# EAGLE design CP2102 USB to Serial Breakout v12 (EAGLE 6.5.0)
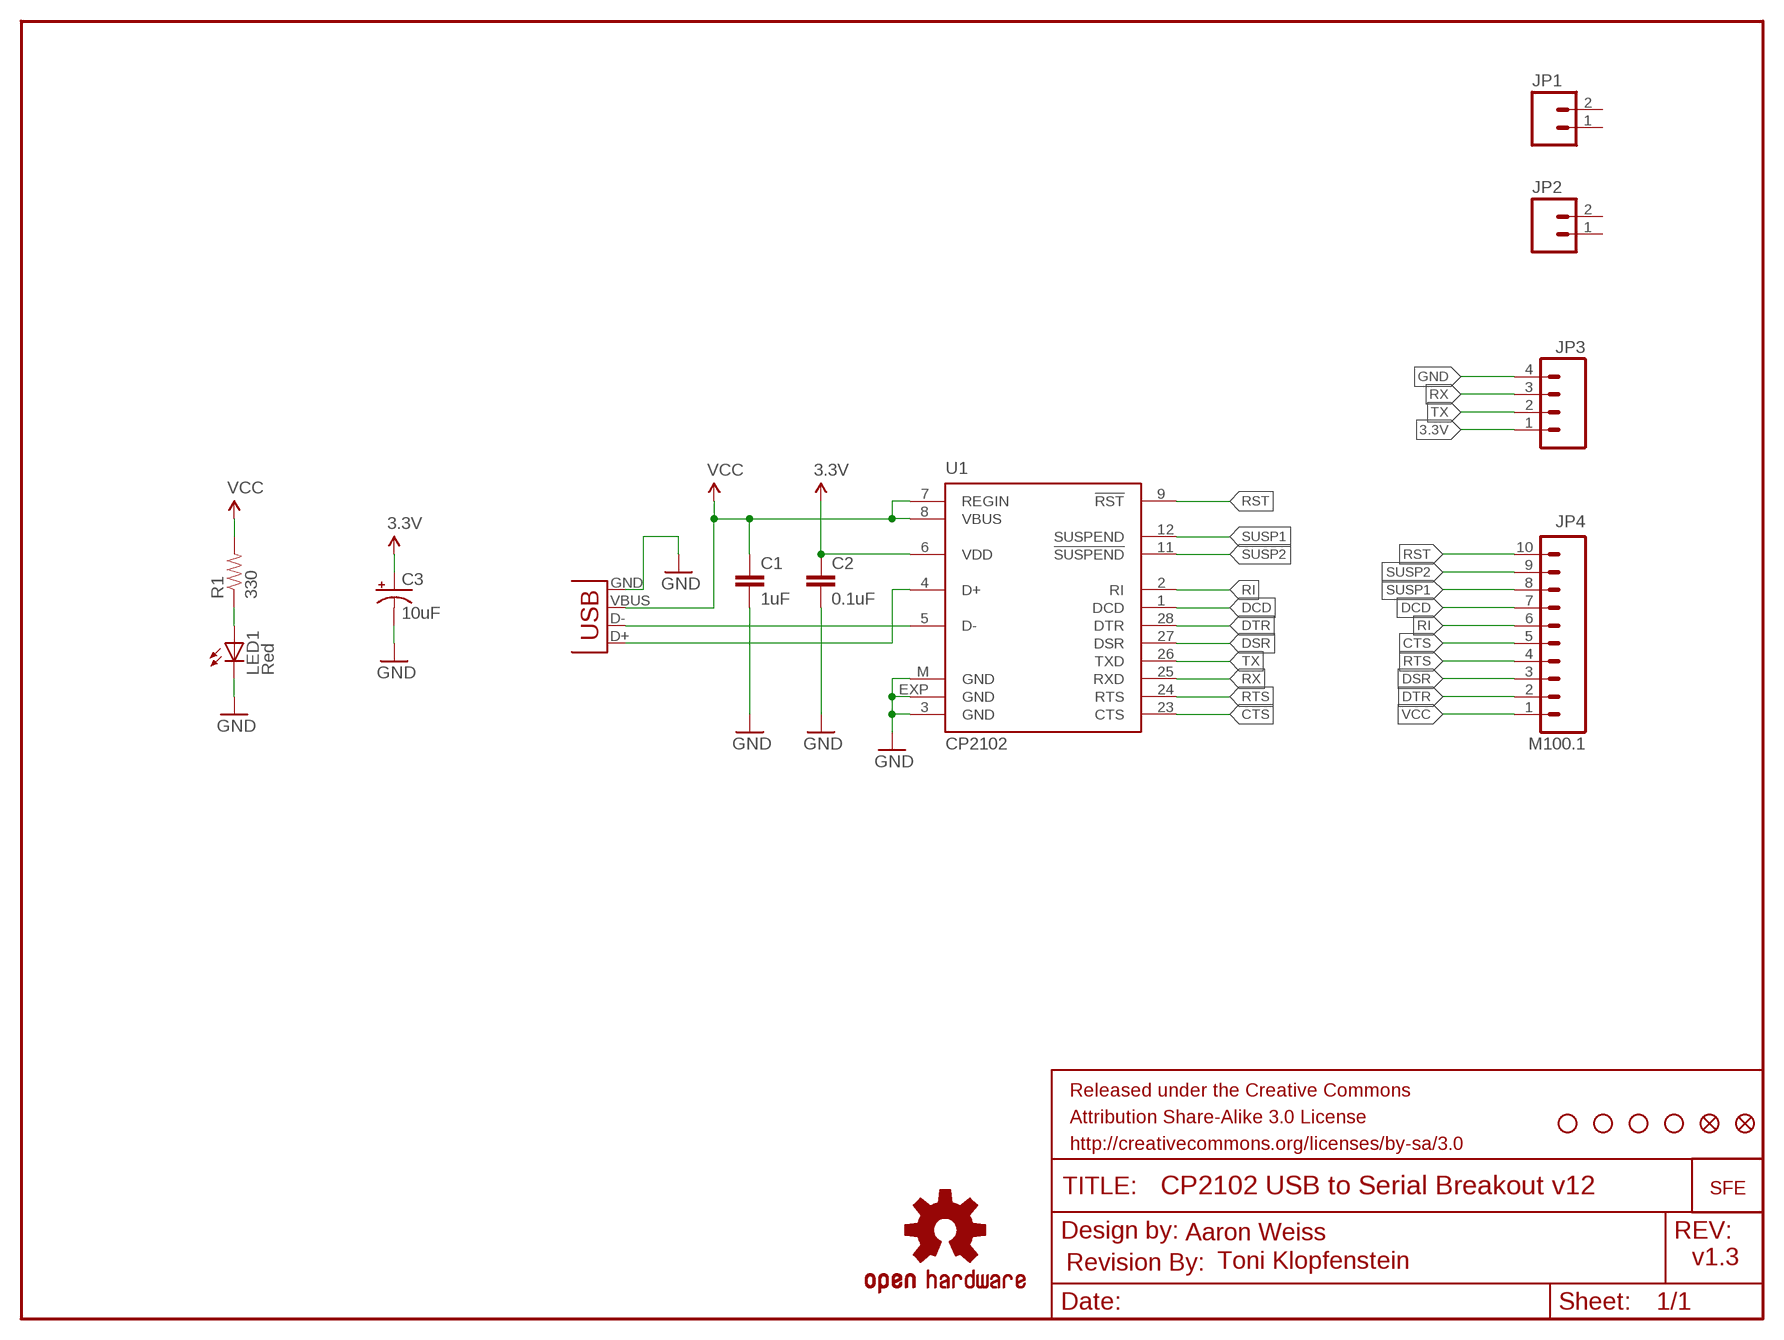
[diagram p0: schematic, sheet 1]

## Parts
C1  1uF  1.0UF-16V-10%(0603)  [0603-CAP]
C2  0.1uF  0.1UF-25V(+80/-20%)(0603)  [0603-CAP]
C3  10uF  CAP_POL1206  [EIA3216]
FRAME1  FRAME-LETTER  [CREATIVE_COMMONS]
JP1  M02PTH  [1X02]
JP2  M02PTH  [1X02]
JP3  M04PTH  [1X04]
JP4  M100.1  [1X10]
LED1  Red  LED1206  [LED-1206]
LOGO1  OSHW-LOGOS  [OSHW-LOGO-S]
R1  330  330OHM1/10W1%(0603)  [0603-RES]
U1  CP2102  CP210X_USB_UART  [MLP28]
U$1  LOGO-SFENEW  [SFE-NEW-WEBLOGO]
U$2  FIDUCIAL1X2  [FIDUCIAL-1X2]
U$3  FIDUCIAL1X2  [FIDUCIAL-1X2]
U$4  REVISION  [REVISION]
U$6  STAND-OFF  [STAND-OFF]
U$7  STAND-OFF  [STAND-OFF]
U$8  STAND-OFF  [STAND-OFF]
U$9  STAND-OFF  [STAND-OFF]
X1  USBPTH  [USB-B-PTH]

## Nets
3.3V: C2.1 C3.A(+) JP3.1 U1.6(VDD)
CTS: JP4.5 U1.23(CTS)
DCD: JP4.7 U1.1(DCD)
DSR: JP4.3 U1.27(DSR)
DTR: JP4.2 U1.28(DTR)
GND: C1.2 C2.2 C3.C(-) JP3.4 LED1.C U1.3(GND) U1.EXP(GND) U1.M(GND) X1.GND
N$1: U1.5(D-) X1.D-
N$2: U1.4(D+) X1.D+
N$3: LED1.A R1.1
RI: JP4.6 U1.2(RI)
RST: JP4.10 U1.9(!RST)
RTS: JP4.4 U1.24(RTS)
RX: JP3.3 U1.25(RXD)
SUSP1: JP4.8 U1.12(SUSPEND)
SUSP2: JP4.9 U1.11(!SUSPEND)
TX: JP3.2 U1.26(TXD)
VCC: C1.1 JP4.1 R1.2 U1.7(REGIN) U1.8(VBUS) X1.VBUS
Unconnected: JP1.1 JP1.2 JP2.1 JP2.2

## Notes on the sheet
- Aaron Weiss
- Toni Klopfenstein | v1.3

## Library data of the parts
C1 = SparkFun-Capacitors:1.0UF-16V-10%(0603): CAP-00868; PROD_ID: CAP-00868; VALUE: 1.0uF
C2 = SparkFun-Capacitors:0.1UF-25V(+80/-20%)(0603): CAP-00810 Ceramic Standard decoupling cap; PROD_ID: CAP-00810
C3 = SparkFun:CAP_POL: Capacitor Polarized These are standard SMD and PTH capacitors. Normally 10uF, 47uF, and 100uF in electrolytic and tantalum varieties. Always verify the external diameter of the through hole cap, it varies with capacity, voltage, and manufacturer. The EIA devices should be standard.
FRAME1 = SparkFun-Aesthetics:FRAME-LETTER: Schematic Frame Standard 8.5x11 US Letter frame
JP1 JP2 = SparkFun:M02: Header 2 Standard 2-pin 0.1" header. Use with straight break away headers (SKU : PRT-00116), right angle break away headers (PRT-00553), swiss pins (PRT-00743), machine pins (PRT-00117), and female headers (PRT-00115). Molex polarized connector foot print use with SKU : PRT-08233 with associated crimp pins and housings.
JP3 = SparkFun:M04: Header 4 Standard 4-pin 0.1" header. Use with straight break away headers (SKU : PRT-00116), right angle break away headers (PRT-00553), swiss pins (PRT-00743), machine pins (PRT-00117), and female headers (PRT-00115). Molex polarized connector foot print use with SKU : PRT-08231 with associated crimp pins and housings.
JP4 = SparkFun:M10: Header 10 Standard 10-pin 0.1" header. Use with straight break away headers (SKU : PRT-00116), right angle break away headers (PRT-00553), swiss pins (PRT-00743), machine pins (PRT-00117), and female headers (PRT-00115).
LED1 = SparkFun:LED: LEDs Standard schematic elements and footprints for 5mm, 3mm, 1206, and 0603 sized LEDs. 5mm - Spark Fun Electronics SKU : COM-00529 (and others)
LOGO1 = SparkFun-Aesthetics:OSHW-LOGO: Open Source Hardware Logo This logo indicates the piece of hardware it is found on incorporates a OSHW license and/or adheres to the definition of open source hardware found here: http://freedomdefined.org/OSHW
R1 = SparkFun-Resistors:330OHM1/10W1%(0603): RES-00818; PROD_ID: RES-00818
U1 = SparkFun:CP210X_USB_UART: Single-Chip USB to UART Bridge Source: www.silabs.com .. CP2101.pdf / cp2102.pdf. Spark Fun Electronics SKU : COM-00310
U$1 = SparkFun:LOGO-SFE: Spark Fun Electronics PCB Logo This is the standard Spark Fun Electronics PCB logo.
U$2 U$3 = SparkFun:FIDUCIAL: Fiducial Alignment Points Various fiducial points for machine vision alignment.
U$4 = SparkFun-Aesthetics:REVISION
U$6-U$9 = SparkFun:STAND-OFF: Stand Off This is the mechanical footprint for a #4 phillips button head screw. Use the keepout ring to avoid running the screw head into surrounding components. SKU : PRT-00447
X1 = SparkFun:USB: USB Connectors USB-B-PTH is fully proven SKU : PRT-00139 USB-miniB is fully proven SKU : PRT-00587 USB-A-PCB is untested. USB-A-H is throughly reviewed, but untested. Spark Fun Electronics SKU : PRT-00437 USB-B-SMT is throughly reviewed, but untested. Needs silkscreen touching up. USB-A-S has not been used/tested USB-MB-H has not been used/tested

## Board
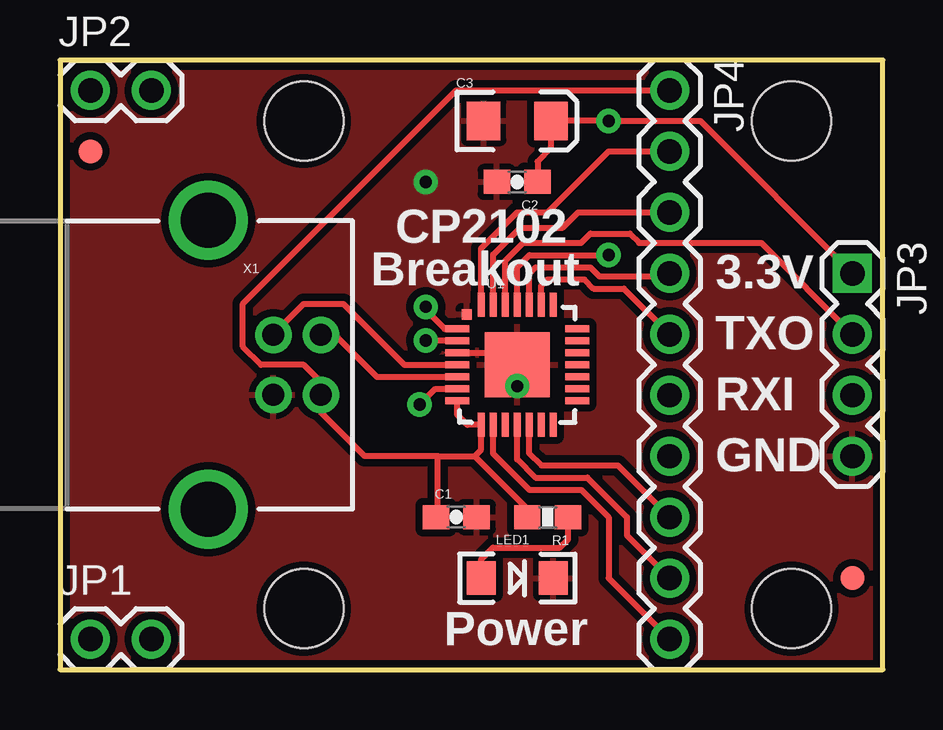
[diagram p1: board, top side]
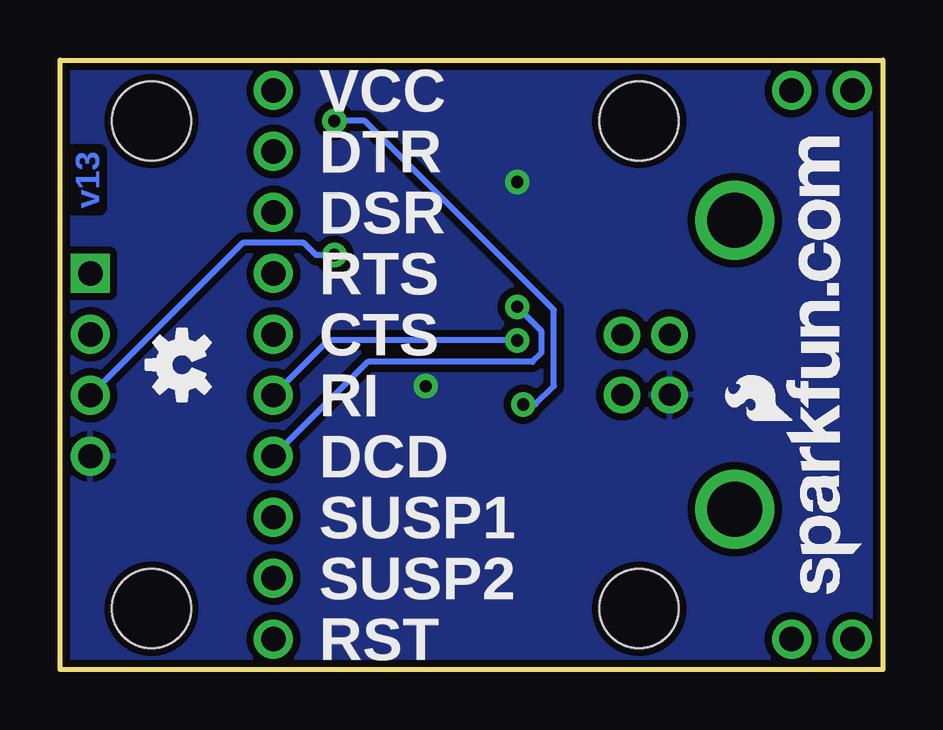
[diagram p2: board, bottom side, seen from below]

Size 34.29 x 25.4 mm. Coordinates in mm from the lower left corner, seen from the top.
Outline: 0,0 34.29,0 34.29,25.4 0,25.4 0,0
Copper layers (1*16): Top 0.035mm / dielectric 1.5mm / Bottom 0.035mm
Design rules "SparkFun *": minimum track width 8mil, minimum drill 20mil, track to track 8mil, track to pad 8mil, pad to pad 7mil, via to via 8mil, smd to smd 8mil, copper to edge 10mil, drill to drill 8mil, minimum pad ring 12mil, minimum via ring 10mil, stop-mask expansion 4mil, vias tented up to drill 25mil, thermal gap 10mil

### Footprints (pad centres in the part's own frame; a part is rotated, then mirrored left to right if it is on the bottom)
0603-CAP = smd 1.1 x 1: 1 -0.85,0; 2 0.85,0
EIA3216 = smd 1.4 x 1.6: A 1.4,0; C -1.4,0
1X02 = drill 1.016: 1 0,0; 2 2.54,0
1X04 = drill 1.016 square: 1 0,0 | drill 1.016: 2 2.54,0; 3 5.08,0; 4 7.62,0
1X10 = drill 1.016: 1 0,0; 2 2.54,0; 3 5.08,0; 4 7.62,0; 5 10.16,0; 6 12.7,0; 7 15.24,0; 8 17.78,0; 9 20.32,0; 10 22.86,0
LED-1206 = smd 1.2 x 1.4: A -1.5,0; C 1.5,0
0603-RES = smd 1.1 x 1: 1 -0.85,0; 2 0.85,0
MLP28 = smd 1 x 0.3: 1 -2.5,1.5; 2 -2.5,1; 3 -2.5,0.5; 4 -2.5,0; 5 -2.5,-0.5; 6 -2.5,-1; 7 -2.5,-1.5; 15 2.5,-1.5; 16 2.5,-1; 17 2.5,-0.5; 18 2.5,0; 19 2.5,0.5; 20 2.5,1; 21 2.5,1.5 | smd 0.3 x 1: 8 -1.5,-2.5; 9 -1,-2.5; 10 -0.5,-2.5; 11 0,-2.5; 12 0.5,-2.5; 13 1,-2.5; 14 1.5,-2.5; 22 1.5,2.5; 23 1,2.5; 24 0.5,2.5; 25 0,2.5; 26 -0.5,2.5; 27 -1,2.5; 28 -1.5,2.5 | smd 2.7 x 2.7: EXP 0,0 | smd 0.435 x 0.435: M -2.103,2.103
FIDUCIAL-1X2 = smd 1 x 1: 1 0,0
STAND-OFF = hole 3.302: 0,0
USB-B-PTH = drill 0.914: D+ 0,1.25; D- 1.981,1.25; GND 0,-1.25; VBUS 1.981,-1.25 | drill 2.286: P$1 -2.718,-6.02; P$2 -2.718,6.02

### Placement (x,y rotation side)
C1  16.51,6.35 0 top
C2  19.05,20.32 180 top
C3  19.05,22.86 0 top
FRAME1  -1.07,-8.89 0 top  (outside the outline)
JP1  1.27,1.27 0 top
JP2  1.27,24.13 0 top
JP3  33.02,16.51 270 top
JP4  25.4,24.13 270 top
LED1  19.05,3.81 0 top
LOGO1  29.21,12.7 90 bottom
R1  20.32,6.35 180 top
U1  19.05,12.7 0 top
U$1  0.89,3.17 90 bottom
U$2  33.02,3.81 0 top
U$3  1.27,21.59 0 top
U$4  10.16,-11.43 0 top  (outside the outline)
U$6  10.16,2.54 0 top
U$7  10.16,22.86 0 top
U$8  30.48,22.86 0 top
U$9  30.48,2.54 0 top
X1  8.89,12.7 0 top

### Tracks (layer width: path | path; a pad name or v marks a point on that pad's centre or on a via)
3.3V  (via drill 0.51)
  Top 0.254: U1.6 15.64,11.7 v14.99,11.05 | JP3.1 26.67,22.86 v22.86,22.86 C3.A 20.45,21.72 19.9,21.17 C2.1
  Bottom 0.254: v14.99,11.05 14.48,11.05 13.72,11.81 13.72,14.99 21.59,22.86 v22.86,22.86
CTS
  Top 0.254: U1.23 20.05,15.99 20.32,16.26 21.84,16.26 22.23,15.88 23.5,15.88 JP4.5
DCD  (via drill 0.51)
  Top 0.254: v15.24,15.11 15.24,14.99 16.03,14.2 U1.1
  Bottom 0.254: v15.24,15.11 14.22,14.1 14.22,13.21 14.61,12.83 21.46,12.83 JP4.7
DSR
  Top 0.254: U1.27 18.05,17.29 19.18,18.41 20.95,18.41 21.59,19.05 JP4.3
DTR
  Top 0.254: U1.28 17.55,17.55 19.05,19.05 20.32,19.05 22.86,21.59 JP4.2
GND  (via drill 0.51)
  Top 0.254: U1.3 18.55,13.2 U1.EXP
  other vias: 15.24,20.32 19.05,11.81
  pour Bottom (isolate 0.305): 0,0 0,25.4 34.29,25.4 34.29,0
  pour Top (isolate 0.305): 0,0 0,25.4 34.29,25.4 34.29,0
N$1
  Top 0.254: X1.D- 11.45,13.95 13.2,12.2 U1.5
N$2
  Top 0.254: U1.4 14.35,12.7 11.81,15.24 10.16,15.24 8.89,13.97 X1.D+
N$3
  Top 0.254: R1.1 21.17,5.42 20.83,5.08 18.03,5.08 17.55,4.6 LED1.A
RI  (via drill 0.51)
  Top 0.254: U1.2 15.26,13.7 v15.24,13.72
  Bottom 0.254: v15.24,13.72 23.11,13.72 JP4.6
RST
  Top 0.254: U1.9 18.05,9 19.56,7.49 21.72,7.49 22.86,6.35 22.86,3.81 JP4.10
RTS
  Top 0.254: U1.24 19.55,16.5 19.81,16.76 22.1,16.76 22.48,16.38 25.27,16.38 JP4.4
RX  (via drill 0.51)
  Top 0.254: U1.25 19.05,16.76 19.56,17.27 v22.86,17.27
  Bottom 0.254: v22.86,17.27 23.62,17.27 24.13,17.78 26.67,17.78 JP3.3
SUSP1
  Top 0.254: U1.12 19.55,9.03 20.07,8.51 23.24,8.51 JP4.8
SUSP2
  Top 0.254: U1.11 19.05,8.76 19.81,8 21.97,8 23.62,6.35 23.62,5.59 JP4.9
TX
  Top 0.254: U1.26 18.55,17.03 19.3,17.78 21.72,17.78 22.1,18.16 23.75,18.16 24.13,17.78 29.21,17.78 JP3.2
VCC
  Top 0.254: JP4.1 16.51,24.13 7.62,15.24 7.62,13.46 8.38,12.7 10.16,12.7 10.87,11.99 X1.VBUS 10.87,10.72 12.7,8.89 15.75,8.89 | 17.27,8.89 17.55,9.17 U1.8 16.98,10.2 16.55,10.63 U1.7 | 15.75,8.89 17.27,8.89 | 15.75,8.89 15.75,6.35 C1.1 | R1.2 19.47,6.69 17.27,8.89

### Text on the board
Bottom: v13
tPlace: CP2102 | Breakout | 3.3V | TXO | RXI | GND | Power
bPlace: VCC | DTR | DSR | RTS | CTS | RI | DCD | SUSP1 | SUSP2 | RST
tDocu: Aaron Weiss | Toni Klopfenstein